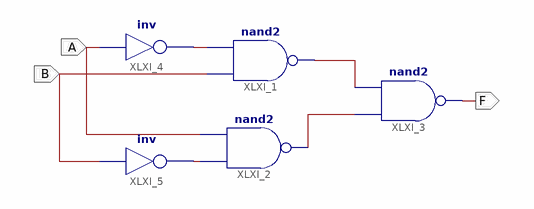
[diagram p0: schematic sheet 1]
// Xilinx ISE schematic test.sch (xc9500) as structural Verilog: 5 symbols, 3 ports
module test (
  input  B,
  input  A,
  output F
);

  wire XLXN_1, XLXN_2, XLXN_3, XLXN_4;

  nand XLXI_1 (XLXN_3, B, XLXN_1);
  nand XLXI_2 (XLXN_4, XLXN_2, A);
  nand XLXI_3 (F, XLXN_4, XLXN_3);
  not XLXI_4 (XLXN_1, A);
  not XLXI_5 (XLXN_2, B);
endmodule
